# EAGLE design Eagle-V2-SunSensor (EAGLE 9.4.2)
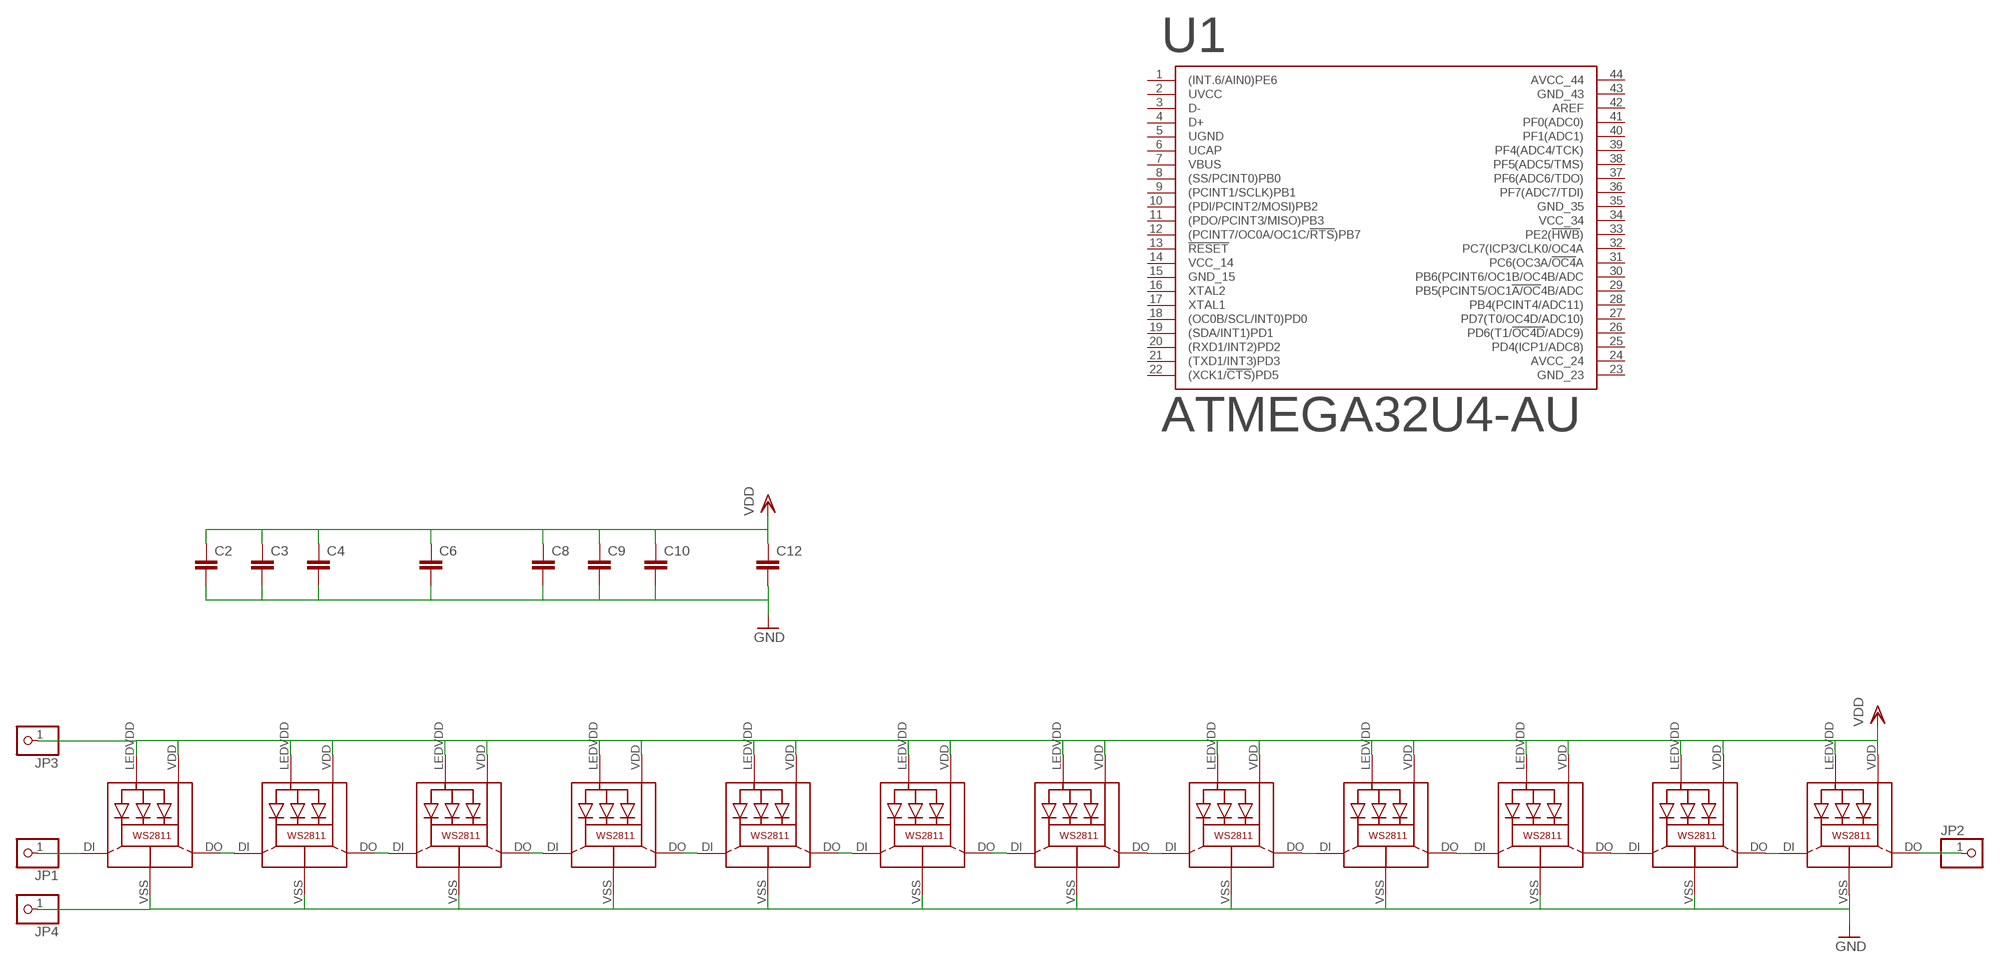
[diagram p0: schematic, sheet 1]

## Parts
C2  C-EUC0603  [C0603]
C3  C-EUC0603  [C0603]
C4  C-EUC0603  [C0603]
C6  C-EUC0603  [C0603]
C8  C-EUC0603  [C0603]
C9  C-EUC0603  [C0603]
C10  C-EUC0603  [C0603]
C12  C-EUC0603  [C0603]
JP1  PINHD-1X1CB  [1X01-CLEANBIG]
JP2  PINHD-1X1CB  [1X01-CLEANBIG]
JP3  PINHD-1X1CB  [1X01-CLEANBIG]
JP4  PINHD-1X1CB  [1X01-CLEANBIG]
LED1  WS28115050  [WS28115050]
LED2  WS28115050  [WS28115050]
LED3  WS28115050  [WS28115050]
LED4  WS28115050  [WS28115050]
LED5  WS28115050  [WS28115050]
LED6  WS28115050  [WS28115050]
LED7  WS28115050  [WS28115050]
LED8  WS28115050  [WS28115050]
LED9  WS28115050  [WS28115050]
LED10  WS28115050  [WS28115050]
LED11  WS28115050  [WS28115050]
LED12  WS28115050  [WS28115050]
U1  ATMEGA32U4-AU  [44-TQFP]

## Nets
GND: C2.2 C3.2 C4.2 C6.2 C8.2 C9.2 C10.2 C12.2 JP4.1 LED1.VSS(GND) LED2.VSS(GND) LED3.VSS(GND) LED4.VSS(GND) LED5.VSS(GND) LED6.VSS(GND) LED7.VSS(GND) LED8.VSS(GND) LED9.VSS(GND) LED10.VSS(GND) LED11.VSS(GND) LED12.VSS(GND)
N$1: LED1.DO LED2.DI
N$2: LED2.DO LED3.DI
N$3: LED3.DO LED4.DI
N$4: LED4.DO LED5.DI
N$5: LED5.DO LED6.DI
N$6: LED6.DO LED7.DI
N$7: LED7.DO LED8.DI
N$8: LED8.DO LED9.DI
N$9: LED9.DO LED10.DI
N$10: LED10.DO LED11.DI
N$11: LED11.DO LED12.DI
N$13: JP1.1 LED1.DI
N$14: JP2.1 LED12.DO
VDD: C2.1 C3.1 C4.1 C6.1 C8.1 C9.1 C10.1 C12.1 JP3.1 LED1.LEDVDD LED1.VDD LED2.LEDVDD LED2.VDD LED3.LEDVDD LED3.VDD LED4.LEDVDD LED4.VDD LED5.LEDVDD LED5.VDD LED6.LEDVDD LED6.VDD LED7.LEDVDD LED7.VDD LED8.LEDVDD LED8.VDD LED9.LEDVDD LED9.VDD LED10.LEDVDD LED10.VDD LED11.LEDVDD LED11.VDD LED12.LEDVDD LED12.VDD
Unconnected: U1.1((INT.6/AIN0)PE6) U1.3(D-) U1.4(D+) U1.7(VBUS) U1.8((SS/PCINT0)PB0) U1.9((PCINT1/SCLK)PB1) U1.10((PDI/PCINT2/MOSI)PB2) U1.11((PDO/PCINT3/MISO)PB3) U1.12((PCINT7/OC0A/OC1C/!RTS!)PB7) U1.13(!RESET) U1.16(XTAL2) U1.17(XTAL1) U1.18((OC0B/SCL/INT0)PD0) U1.19((SDA/INT1)PD1) U1.20((RXD1/INT2)PD2) U1.21((TXD1/INT3)PD3) U1.22((XCK1/!CTS!)PD5) U1.25(PD4(ICP1/ADC8)) U1.26(PD6(T1/!OC4D!/ADC9)) U1.27(PD7(T0/OC4D/ADC10)) U1.28(PB4(PCINT4/ADC11)) U1.29(PB5(PCINT5/OC1!A/OC!4B/ADC) U1.30(PB6(PCINT6/OC1B/OC4B/ADC) U1.31(PC6(OC3A/!OC4!A) U1.32(PC7(ICP3/CLK0/OC4A) U1.33(PE2(!HWB!)) U1.36(PF7(ADC7/TDI)) U1.37(PF6(ADC6/TDO)) U1.38(PF5(ADC5/TMS)) U1.39(PF4(ADC4/TCK)) U1.40(PF1(ADC1)) U1.41(PF0(ADC0)) U1.42(AREF)

## Power pins joined to a net without a drawn wire
AVCC_24: U1.24(AVCC_24)
AVCC_44: U1.44(AVCC_44)
GND_15: U1.15(GND_15)
GND_23: U1.23(GND_23)
GND_35: U1.35(GND_35)
GND_43: U1.43(GND_43)
UCAP: U1.6(UCAP)
UGND: U1.5(UGND)
UVCC: U1.2(UVCC)
VCC_14: U1.14(VCC_14)
VCC_34: U1.34(VCC_34)

## Library data of the parts
C2-C4 C6 C8-C10 C12 = rcl:C-EU: CAPACITOR, European symbol
JP1-JP4 = NeoPixelRing:PINHD-1X1: Pin header 1x1 for 0.1" spacing With round pins
LED1-LED12 = microbuilder:WS28115050
U1 = Microcontroller:ATMEGA32U4-AU: IC MCU 8BIT 32KB FLASH 44TQFP Manufacturer's datasheet <http://ww1.microchip.com/downloads/en/DeviceDoc/Atmel-7766-8-bit-AVR-ATmega16U4-32U4_Summary.pdf>; CREATED_BY: PCBLayout.com; DIGIKEY_PART_NUMBER: ATMEGA32U4-AU-ND; MANUFACTURER: Microchip Technology; MPN: ATMEGA32U4-AU; PACKAGE: 44-TQFP

## Board
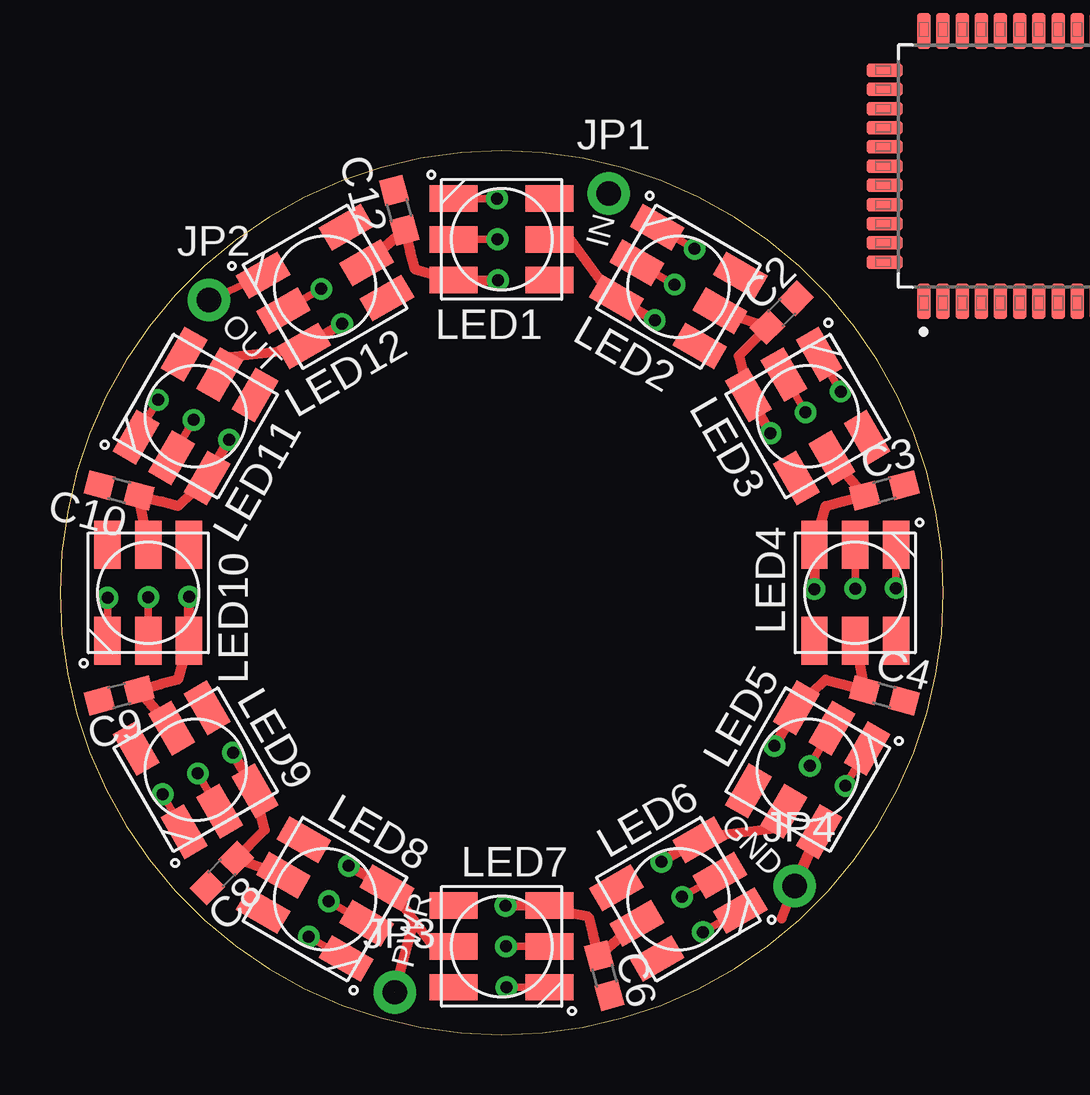
[diagram p1: board, top side]
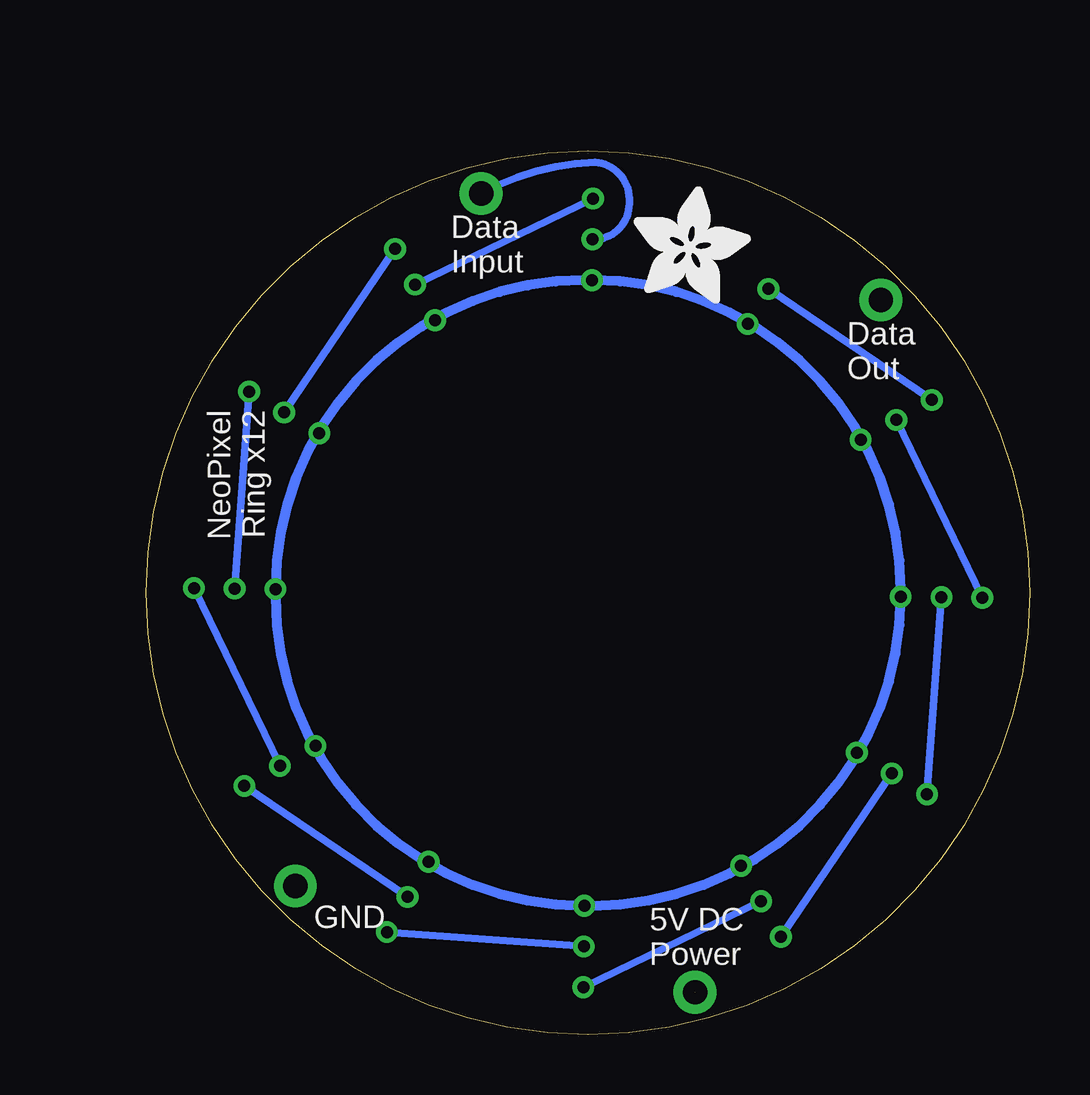
[diagram p2: board, bottom side, seen from below]

Size 36.83 x 36.83 mm. Coordinates in mm from the lower left corner, seen from the top.
Outline: 0,18.41 arc90 18.41,0 arc90 36.83,18.41 arc90 18.41,36.83 arc90 0,18.41
Copper layers (1*16): Top 0.035mm / dielectric 1.5mm / Bottom 0.035mm
Design rules "adafruit": minimum track width 8mil, minimum drill 15.5mil, track to track 8mil, track to pad 8mil, pad to pad 8mil, via to via 8mil, smd to smd 8mil, copper to edge 10mil, drill to drill 8mil, minimum pad ring 10mil, minimum via ring 8mil, stop-mask expansion 4mil, vias tented up to drill 20mil, thermal gap 10mil

### Footprints (pad centres in the part's own frame; a part is rotated, then mirrored left to right if it is on the bottom)
C0603 = smd 1.1 x 1: 1 -0.85,0; 2 0.85,0
1X01-CLEANBIG = drill 1.016 pad 1.778: 1 0,0
WS28115050 = smd 2 x 1.1: DI 2,0; DO 2,-1.7; LEDVDD -2,0; NC -2,1.7; VDD 2,1.7; VSS -2,-1.7
44-TQFP = smd 0.57 x 1.5: 1 -4,-5.63; 2 -3.2,-5.63; 3 -2.4,-5.63; 4 -1.6,-5.63; 5 -0.8,-5.63; 6 0,-5.63; 7 0.8,-5.63; 8 1.6,-5.63; 9 2.4,-5.63; 10 3.2,-5.63; 11 4,-5.63; 23 4,5.63; 24 3.2,5.63; 25 2.4,5.63; 26 1.6,5.63; 27 0.8,5.63; 28 0,5.63; 29 -0.8,5.63; 30 -1.6,5.63; 31 -2.4,5.63; 32 -3.2,5.63; 33 -4,5.63 | smd 1.5 x 0.57: 12 5.63,-4; 13 5.63,-3.2; 14 5.63,-2.4; 15 5.63,-1.6; 16 5.63,-0.8; 17 5.63,0; 18 5.63,0.8; 19 5.63,1.6; 20 5.63,2.4; 21 5.63,3.2; 22 5.63,4; 34 -5.63,4; 35 -5.63,3.2; 36 -5.63,2.4; 37 -5.63,1.6; 38 -5.63,0.8; 39 -5.63,0; 40 -5.63,-0.8; 41 -5.63,-1.6; 42 -5.63,-2.4; 43 -5.63,-3.2; 44 -5.63,-4

### Placement (x,y rotation side)
C2  30.09,30.09 45 top
C3  34.36,22.69 15 top
C4  34.36,14.14 345 top
C6  22.69,2.47 285 top
C8  6.74,6.74 225 top
C9  2.47,14.14 195 top
C10  2.47,22.69 165 top
C12  14.14,34.36 105 top
JP1  22.87,35.05 0 top
JP2  6.21,30.62 0 top
JP3  13.96,1.77 0 top
JP4  30.62,6.21 0 top
LED1  18.41,33.15 180 top
LED2  25.78,31.17 150 top
LED3  31.17,25.78 120 top
LED4  33.15,18.41 90 top
LED5  31.17,11.05 60 top
LED6  25.78,5.66 30 top
LED7  18.41,3.68 0 top
LED8  11.05,5.66 330 top
LED9  5.66,11.05 300 top
LED10  3.68,18.41 270 top
LED11  5.66,25.78 240 top
LED12  11.05,31.17 210 top
U1  40,36.2 0 top
U$3  [ADAFRUIT_5MM]  16.51,30.48 0 bottom

### Tracks (layer width: path | path; a pad name or v marks a point on that pad's centre or on a via)
GND
  Top 0.406: JP4.1 30.08,4.85
  Top 0.457: JP4.1 LED5.VSS
N$1  (via drill 0.5)
  Top 0.305: LED1.DO v18.21,34.85 | LED2.DI v25.62,31.26
  Bottom 0.305: v18.21,34.85 v25.62,31.26
N$2  (via drill 0.5)
  Top 0.305: LED2.DO v26.46,32.74 | LED3.DI v31.08,25.94
  Bottom 0.305: v26.46,32.74 v31.08,25.94
N$3  (via drill 0.5)
  Top 0.305: LED3.DO v32.54,26.8 | LED4.DI v33.15,18.59
  Bottom 0.305: v32.54,26.8 v33.15,18.59
N$4  (via drill 0.5)
  Top 0.305: LED4.DO v34.85,18.62 | LED5.DI v31.26,11.2
  Bottom 0.305: v34.85,18.62 v31.26,11.2
N$5  (via drill 0.5)
  Top 0.305: LED5.DO v32.74,10.37 | LED6.DI v25.94,5.75
  Bottom 0.305: v32.74,10.37 v25.94,5.75
N$6  (via drill 0.5)
  Top 0.305: LED6.DO v26.8,4.29 | LED7.DI v18.59,3.68
  Bottom 0.305: v26.8,4.29 v18.59,3.68
N$7  (via drill 0.5)
  Top 0.305: LED7.DO v18.62,1.98 | LED8.DI v11.2,5.57
  Bottom 0.305: v18.62,1.98 v11.2,5.57
N$8  (via drill 0.5)
  Top 0.305: LED8.DO v10.37,4.08 | LED9.DI v5.75,10.89
  Bottom 0.305: v10.37,4.08 v5.75,10.89
N$9  (via drill 0.5)
  Top 0.305: LED9.DO v4.29,10.03 | LED10.DI v3.68,18.23
  Bottom 0.305: v4.29,10.03 v3.68,18.23
N$10  (via drill 0.5)
  Top 0.305: LED10.DO v1.98,18.21 | LED11.DI v5.57,25.62
  Bottom 0.305: v1.98,18.21 v5.57,25.62
N$11  (via drill 0.5)
  Top 0.305: LED11.DO v4.08,26.46 | LED12.DI v10.89,31.08
  Bottom 0.305: v4.08,26.46 v10.89,31.08
N$13  (via drill 0.5)
  Top 0.305: LED1.DI v18.23,33.15
  Bottom 0.305: v18.23,33.15 18.18,33.15 arc-90 16.7,34.63 16.7,34.7 arc-90 18.13,36.36 arc-26 JP1.1
N$14
  Top 0.305: LED12.DO JP2.1
VDD  (via drill 0.5)  (1 unrouted)
  Top 0.406: v18.26,31.45 LED1.VDD 14.8,31.91 14.6,32.64 C12.1 LED12.LEDVDD | v24.79,29.78 LED2.VDD 22.5,31.49 21.15,33.29 LED1.LEDVDD | LED2.LEDVDD C2.1 28.29,28.29 LED3.VDD v29.62,25.07 | LED3.LEDVDD C3.1 32.64,22.23 31.91,22.03 LED4.VDD v31.45,18.57 | LED4.LEDVDD C4.1 32.64,14.6 31.91,14.8 LED5.VDD v29.78,12.04 | v25.07,7.21 LED6.VDD 27.55,8.31 29.77,8.59 LED5.LEDVDD | LED6.LEDVDD C6.1 22.23,4.18 22.03,4.92 19.68,5.38 | LED7.VDD 19.68,5.38 | 19.68,5.38 v18.57,5.38 | v12.04,7.05 LED8.VDD 14.21,5.51 15.58,3.67 LED7.LEDVDD | v7.21,11.76 LED9.VDD 8.54,8.54 C8.1 LED8.LEDVDD | LED9.LEDVDD C9.1 4.18,14.6 4.92,14.8 LED10.VDD v5.38,18.26 | LED10.LEDVDD C10.1 4.18,22.23 4.92,22.03 LED11.VDD v7.05,24.79 | v11.76,29.62 LED12.VDD 9.54,28.53 7.08,28.24 LED11.LEDVDD | JP3.1 14.76,4.76
  Bottom 0.406: v18.57,5.38 18.26,5.38 arc-90 v5.38,18.26 5.38,18.57 arc-90 v18.26,31.45 18.57,31.45 arc-90 v31.45,18.57 31.45,18.25 arc-90 v18.57,5.38

### Text on the board
tPlace: IN | OUT | GND | PWR
bPlace: Data / Input | Data / Out | NeoPixel / Ring x12 | GND | 5V DC / Power